# EAGLE design GSWB (EAGLE 7.6.0)
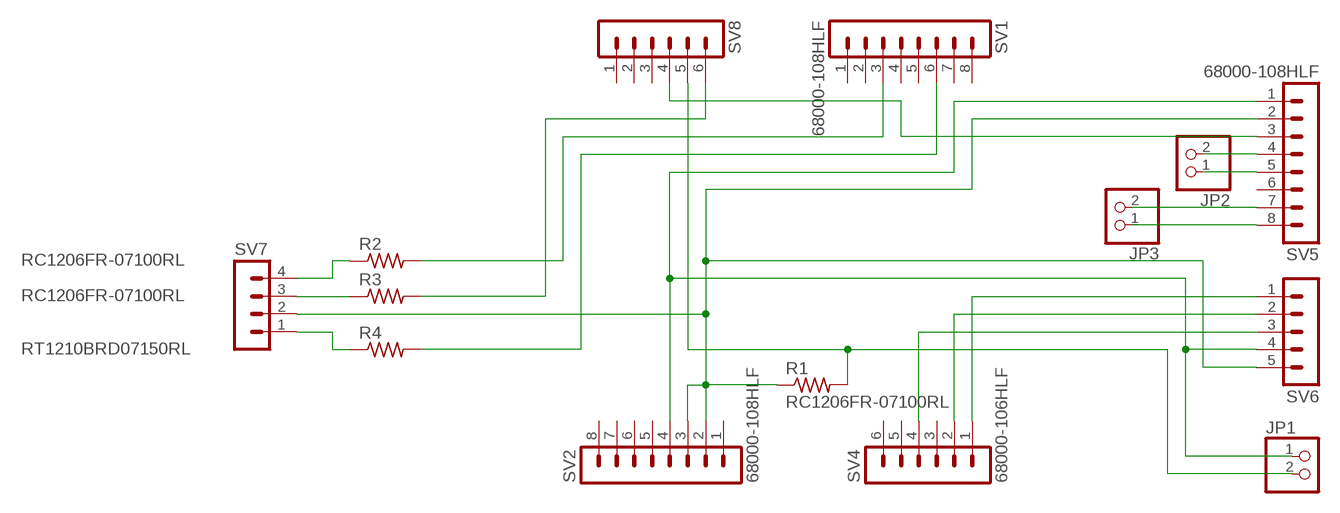
[diagram p0: schematic, sheet 1]

## Parts
JP1  PINHD-1X2  [1X02]
JP2  PINHD-1X2  [1X02]
JP3  PINHD-1X2  [1X02]
R1  RC1206FR-07100RL  R-US_M1206  [M1206]
R2  RC1206FR-07100RL  R-US_M1206  [M1206]
R3  RC1206FR-07100RL  R-US_M1206  [M1206]
R4  RT1210BRD07150RL  R-US_M1206  [M1206]
SV1  68000-108HLF  MA08-1  [MA08-1]
SV2  68000-108HLF  MA08-1  [MA08-1]
SV4  68000-106HLF  MA06-1  [MA06-1]
SV5  68000-108HLF  MA08-1  [MA08-1]
SV6  MA05-1  [MA05-1]
SV7  MA04-1  [MA04-1]
SV8  MA06-1  [MA06-1]

## Nets
EN_GND: JP1.1 SV2.4 SV5.1 SV6.4
GND: R1.1 SV2.2 SV2.3 SV5.2 SV6.5 SV7.2
N$1: JP3.2 SV5.7
N$2: R3.1 SV7.3
N$3: R2.1 SV7.4
N$4: R3.2 SV8.6
N$5: R2.2 SV1.3
N$6: R4.2 SV1.6
N$7: JP2.2 SV5.4
N$9: SV4.1 SV6.1
N$10: JP2.1 SV5.5
N$11: SV4.2 SV6.2
N$12: SV4.4 SV6.3
N$13: JP3.1 SV5.8
N$14: R4.1 SV7.1
N$15: SV5.3 SV8.4
SW5V: JP1.2 R1.2 SV8.5
Unconnected: SV1.1 SV1.2 SV1.4 SV1.5 SV1.7 SV1.8 SV2.1 SV2.5 SV2.6 SV2.7 SV2.8 SV4.3 SV4.5 SV4.6 SV5.6 SV8.1 SV8.2 SV8.3

## Library data of the parts
JP1-JP3 = pinhead:PINHD-1X2: PIN HEADER
R1-R4 = rcl:R-US_: RESISTOR, American symbol
SV1 SV2 SV5 = con-lstb:MA08-1: PIN HEADER; OC_FARNELL: unknown; OC_NEWARK: unknown
SV4 SV8 = con-lstb:MA06-1: PIN HEADER; OC_FARNELL: unknown; OC_NEWARK: unknown
SV6 = con-lstb:MA05-1: PIN HEADER; OC_FARNELL: unknown; OC_NEWARK: unknown
SV7 = con-lstb:MA04-1: PIN HEADER; OC_FARNELL: unknown; OC_NEWARK: unknown

## Board
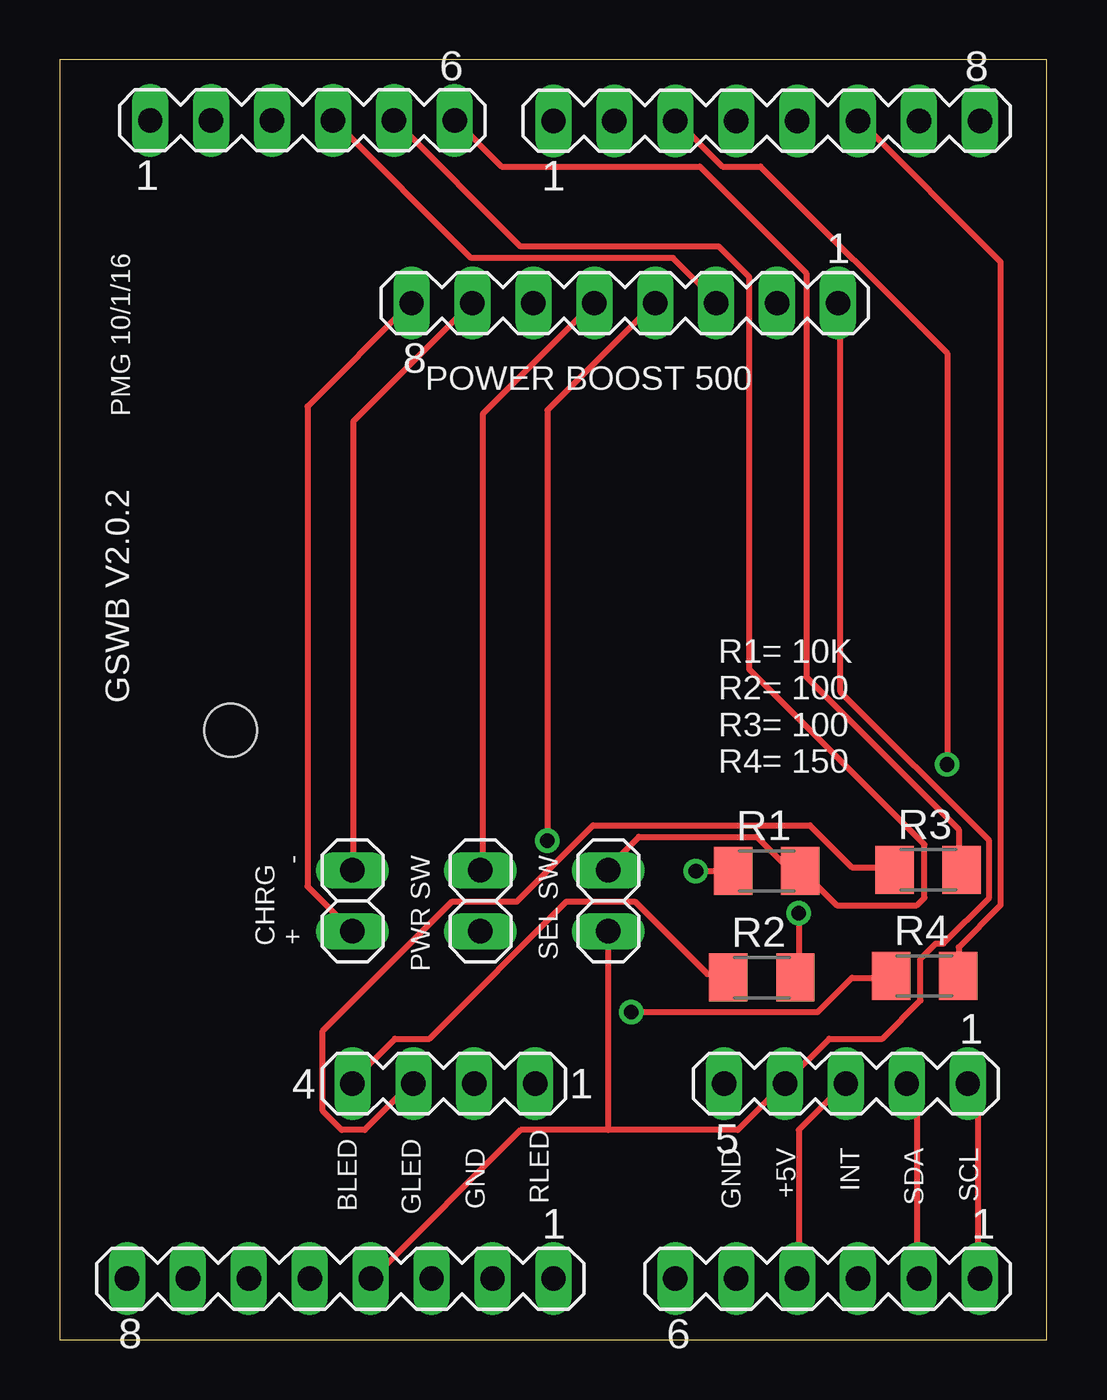
[diagram p1: board, top side]
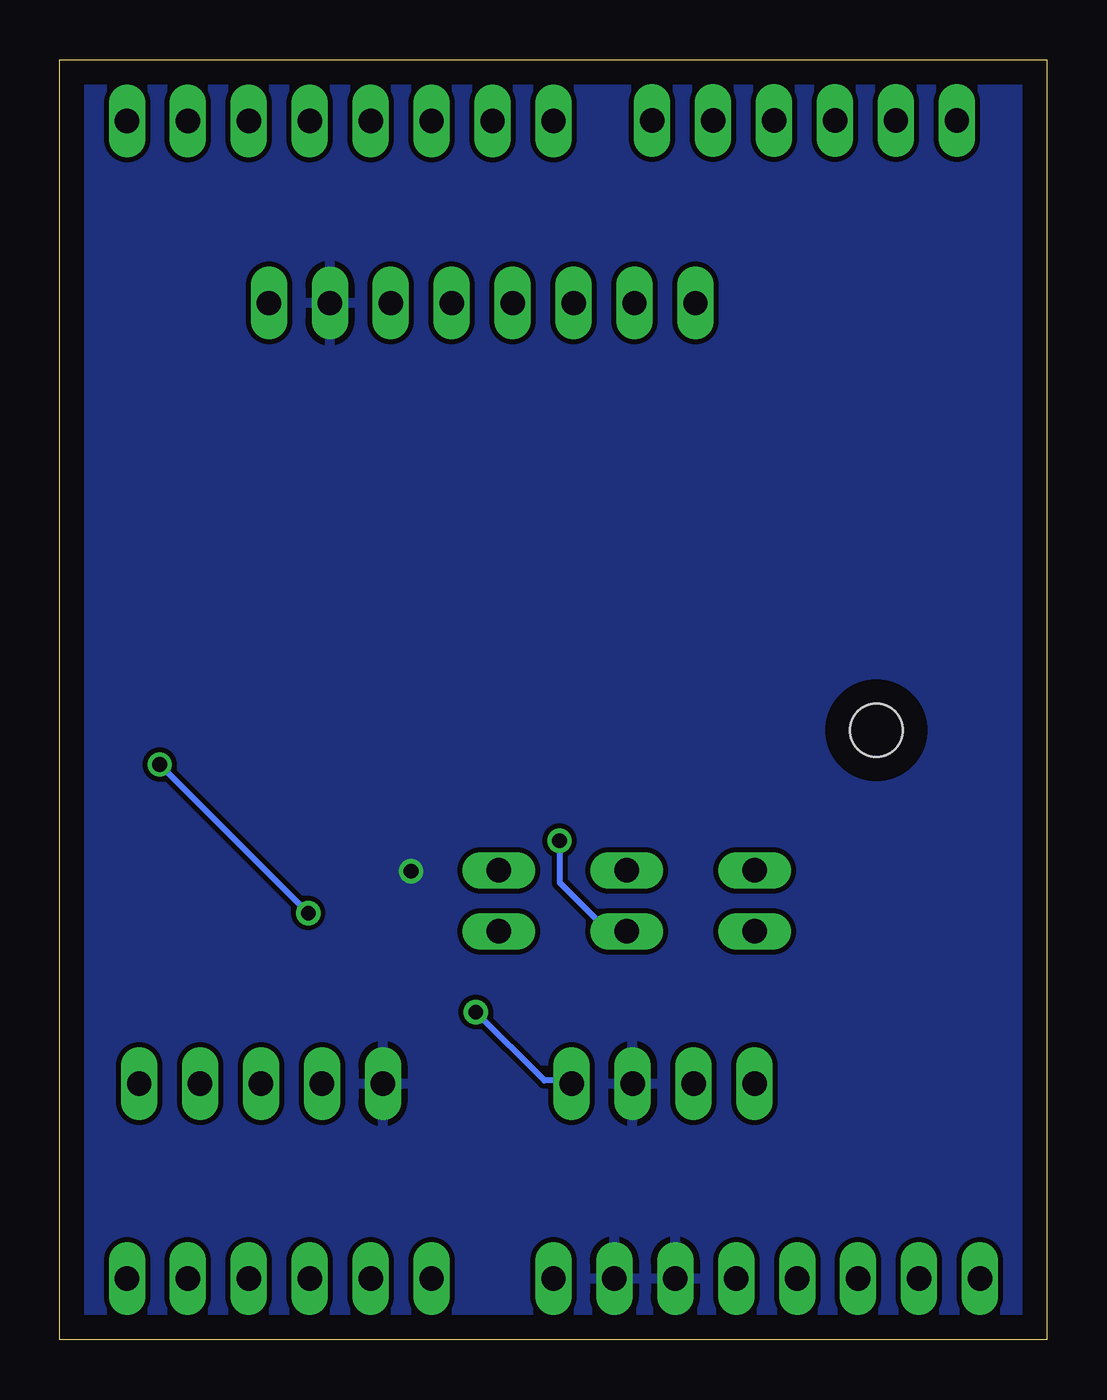
[diagram p2: board, bottom side, seen from below]

Size 41.15 x 53.34 mm. Coordinates in mm from the lower left corner, seen from the top.
Outline: 0,0 41.15,0 41.15,53.34 0,53.34 0,0
Copper layers (1*16): Top 0.035mm / dielectric 1.5mm / Bottom 0.035mm
Design rules "default": minimum track width 10mil, minimum drill 24mil, track to track 8mil, track to pad 8mil, pad to pad 8mil, via to via 8mil, smd to smd 8mil, copper to edge 40mil, drill to drill 8mil, minimum pad ring 10mil, minimum via ring 8mil, stop-mask expansion 4mil, vias tented up to drill 0mil, thermal gap 10mil
Holes 2.2 mm at 7.11,25.4

### Footprints (pad centres in the part's own frame; a part is rotated, then mirrored left to right if it is on the bottom)
1X02 = drill 1.016 long: 1 -1.27,0; 2 1.27,0
M1206 = smd 1.6 x 2: 1 -1.4,0; 2 1.4,0
MA08-1 = drill 1.016 long: 1 -8.89,0; 2 -6.35,0; 3 -3.81,0; 4 -1.27,0; 5 1.27,0; 6 3.81,0; 7 6.35,0; 8 8.89,0
MA06-1 = drill 1.016 long: 1 -6.35,0; 2 -3.81,0; 3 -1.27,0; 4 1.27,0; 5 3.81,0; 6 6.35,0
MA05-1 = drill 1.016 long: 1 -5.08,0; 2 -2.54,0; 3 0,0; 4 2.54,0; 5 5.08,0
MA04-1 = drill 1.016 long: 1 -3.81,0; 2 -1.27,0; 3 1.27,0; 4 3.81,0

### Placement (x,y rotation side)
JP1  22.86,18.29 90 top
JP2  17.53,18.29 270 top
JP3  12.19,18.29 90 top
R1  29.46,19.53 0 top
R2  29.26,15.09 0 top
R3  36.2,19.58 0 top
R4  36.04,15.16 0 top
SV1  29.46,50.8 0 top
SV2  11.68,2.54 180 top
SV4  32,2.54 180 top
SV5  23.55,43.21 180 top
SV6  32.77,10.67 180 top
SV7  16,10.67 180 top
SV8  10.11,50.83 0 top

### Tracks (layer width: path | path; a pad name or v marks a point on that pad's centre or on a via)
EN_GND
  Top 0.254: 22.86,8.73 28.26,8.73 30.16,10.64 SV6.4 30.32,10.79 32.07,12.54 34.29,12.54 35.88,14.13 35.88,15.88 36.51,16.51 36.83,16.51 38.73,18.41 38.73,20.8 32.54,26.99 32.54,43.18 SV5.1 | 22.86,8.73 19.21,8.73 13.02,2.54 SV2.4 | 22.86,8.73 JP1.1
GND  (via drill 0.61)
  Top 0.254: v26.51,19.53 27.94,19.53 R1.1
  pour Bottom: 0,53.34 0,0 41.15,0.76 41.15,53.34
N$1
  Top 0.254: JP3.2 12.22,19.68 12.22,38.26 17.14,43.18 SV5.7
N$2
  Top 0.254: R3.1 34.77,19.68 33.02,19.68 31.27,21.43 22.23,21.43 19.05,18.26 16.35,18.26 10.95,12.86 10.95,9.53 11.75,8.73 12.7,8.73 14.61,10.64 SV7.3
N$3
  Top 0.254: R2.1 27.78,15.24 26.99,15.24 23.97,18.26 21.11,18.26 15.4,12.54 13.97,12.54 12.22,10.79 SV7.4
N$4
  Top 0.254: R3.2 37.47,19.68 37.47,21.27 31.11,27.62 31.11,44.45 26.67,48.9 18.41,48.9 16.51,50.8 SV8.6
N$5  (via drill 0.61)
  Top 0.254: v30.8,17.78 30.8,15.24 R2.2 | v36.99,23.97 36.99,41.12 29.21,48.9 27.62,48.9 25.72,50.8 SV1.3
  Bottom 0.254: v36.99,23.97 v30.8,17.78
N$6
  Top 0.254: R4.2 37.47,15.24 37.47,16.35 39.21,18.1 39.21,44.93 33.34,50.8 SV1.6
N$7  (via drill 0.61)
  Top 0.254: v20.32,20.8 20.32,38.73 24.77,43.18 SV5.4
  Bottom 0.254: v20.32,20.8 20.32,19.05 18.41,17.14 17.62,17.14 JP2.2
N$9
  Top 0.254: SV4.1 38.26,2.54 38.26,10.32 37.94,10.64 SV6.1
N$10
  Top 0.254: JP2.1 17.62,19.68 17.62,38.58 22.23,43.18 SV5.5
N$11
  Top 0.254: SV4.2 35.72,2.54 35.72,10.32 35.4,10.64 SV6.2
N$12
  Top 0.254: SV4.4 30.8,2.54 30.8,8.73 32.7,10.64 SV6.3
N$13
  Top 0.254: JP3.1 10.32,18.89 10.32,38.89 14.61,43.18 SV5.8
N$14  (via drill 0.61)
  Top 0.254: v23.81,13.65 31.59,13.65 33.02,15.08 34.61,15.08 R4.1
  Bottom 0.254: v23.81,13.65 20.95,10.79 19.84,10.79 SV7.1
N$15
  Top 0.254: SV8.4 11.43,50.8 17.14,45.09 25.56,45.09 27.3,43.34 SV5.3
SW5V
  Top 0.254: JP1.2 22.86,19.68 24.13,20.95 29.05,20.95 30.32,19.68 30.8,19.68 R1.2 30.96,19.53 32.38,18.1 35.72,18.1 36.04,18.41 36.04,20.64 28.73,27.94 28.73,44.29 27.46,45.56 19.21,45.56 13.97,50.8 SV8.5

### Text on the board
tNames: R1= 10K / R2= 100 / R3= 100 / R4= 150
_tsilk: POWER BOOST 500 | PMG 10/1/16 | GSWB V2.0.2 | CHRG | - | PWR SW | SEL SW | + | RLED | BLED | GLED | GND | GND | +5V | INT | SDA | SCL